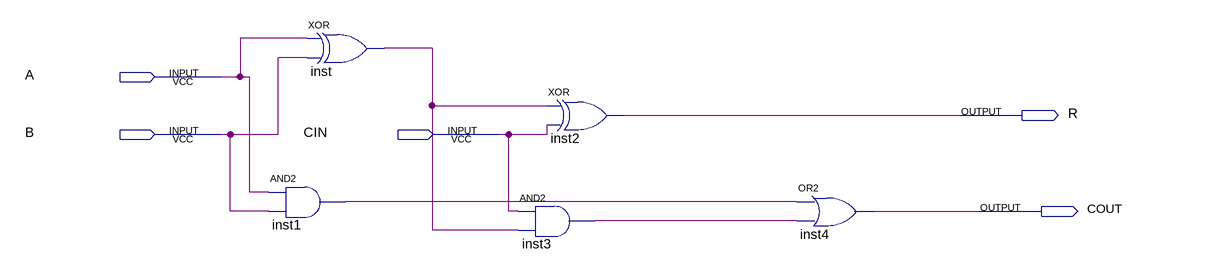
[diagram p0: schematic sheet]
// Quartus schematic FA.bdf as structural Verilog: 5 symbols, 5 pins
module FA (
  input  A,
  input  B,
  input  CIN,
  output R,
  output COUT
);

  wire inst1_out, inst3_out, inst_out;

  xor inst (inst_out, A, B);
  and inst1 (inst1_out, A, B);
  xor inst2 (R, inst_out, CIN);
  and inst3 (inst3_out, CIN, inst_out);
  or inst4 (COUT, inst1_out, inst3_out);
endmodule
